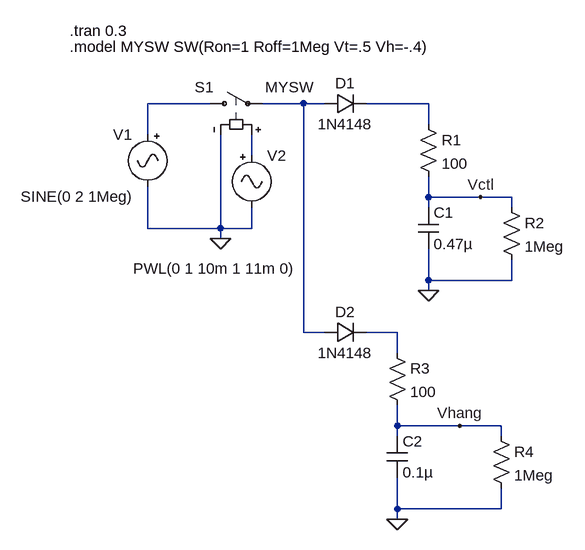
[diagram p0: schematic agc.asc]
agc.asc, the LTspice schematic file:
Version 4
SHEET 1 880 868
WIRE 112 192 16 192
WIRE 256 192 192 192
WIRE 288 192 256 192
WIRE 448 192 352 192
WIRE 448 224 448 192
WIRE 16 240 16 192
WIRE 176 272 176 240
WIRE 448 336 448 304
WIRE 528 336 448 336
WIRE 576 336 528 336
WIRE 448 352 448 336
WIRE 576 352 576 336
WIRE 16 384 16 320
WIRE 128 384 128 240
WIRE 128 384 16 384
WIRE 176 384 176 352
WIRE 176 384 128 384
WIRE 128 400 128 384
WIRE 448 464 448 416
WIRE 576 464 576 432
WIRE 576 464 448 464
WIRE 448 480 448 464
WIRE 256 544 256 192
WIRE 288 544 256 544
WIRE 400 544 352 544
WIRE 400 576 400 544
WIRE 400 688 400 656
WIRE 496 688 400 688
WIRE 560 688 496 688
WIRE 400 704 400 688
WIRE 560 704 560 688
WIRE 400 816 400 768
WIRE 560 816 560 784
WIRE 560 816 400 816
WIRE 400 832 400 816
FLAG 128 400 0
FLAG 448 480 0
FLAG 528 336 Vctl
FLAG 400 832 0
FLAG 496 688 Vhang
SYMBOL sw 96 192 R270
WINDOW 0 25 -8 VRight 2
WINDOW 3 25 101 VRight 2
SYMATTR InstName S1
SYMATTR Value MYSW
SYMBOL diode 288 208 R270
WINDOW 0 32 32 VTop 2
WINDOW 3 0 32 VBottom 2
SYMATTR InstName D1
SYMATTR Value 1N4148
SYMBOL Misc\\signal 16 224 M0
WINDOW 3 22 111 Left 2
WINDOW 123 0 0 Left 0
WINDOW 39 0 0 Left 0
SYMATTR InstName V1
SYMATTR Value SINE(0 2 1Meg)
SYMBOL Misc\\signal 176 256 R0
WINDOW 3 -182 190 Left 2
WINDOW 123 0 0 Left 0
WINDOW 39 0 0 Left 0
SYMATTR InstName V2
SYMATTR Value PWL(0 1 10m 1 11m 0)
SYMBOL res 432 208 R0
SYMATTR InstName R1
SYMATTR Value 100
SYMBOL cap 432 352 R0
SYMATTR InstName C1
SYMATTR Value 0.47µ
SYMBOL res 560 336 R0
SYMATTR InstName R2
SYMATTR Value 1Meg
SYMBOL res 384 560 R0
SYMATTR InstName R3
SYMATTR Value 100
SYMBOL cap 384 704 R0
SYMATTR InstName C2
SYMATTR Value 0.1µ
SYMBOL res 544 688 R0
SYMATTR InstName R4
SYMATTR Value 1Meg
SYMBOL diode 288 560 R270
WINDOW 0 32 32 VTop 2
WINDOW 3 0 32 VBottom 2
SYMATTR InstName D2
SYMATTR Value 1N4148
TEXT -104 104 Left 2 !.model MYSW SW(Ron=1 Roff=1Meg Vt=.5 Vh=-.4)
TEXT -104 80 Left 2 !.tran 0.3

The netlist it stands for:
* agc.asc
S1 N001 N002 N004 0 MYSW
D1 N002 N003 1N4148
V1 N001 0 SINE(0 2 1Meg)
V2 N004 0 PWL(0 1 10m 1 11m 0)
R1 N003 Vctl 100
C1 Vctl 0 0.47µ
R2 Vctl 0 1Meg
R3 N005 Vhang 100
C2 Vhang 0 0.1µ
R4 Vhang 0 1Meg
D2 N002 N005 1N4148
.model D D
.lib standard.dio
.model MYSW SW(Ron=1 Roff=1Meg Vt=.5 Vh=-.4)
.tran 0.3
.backanno
.end